# Altium project gpn-badge.PrjPcb
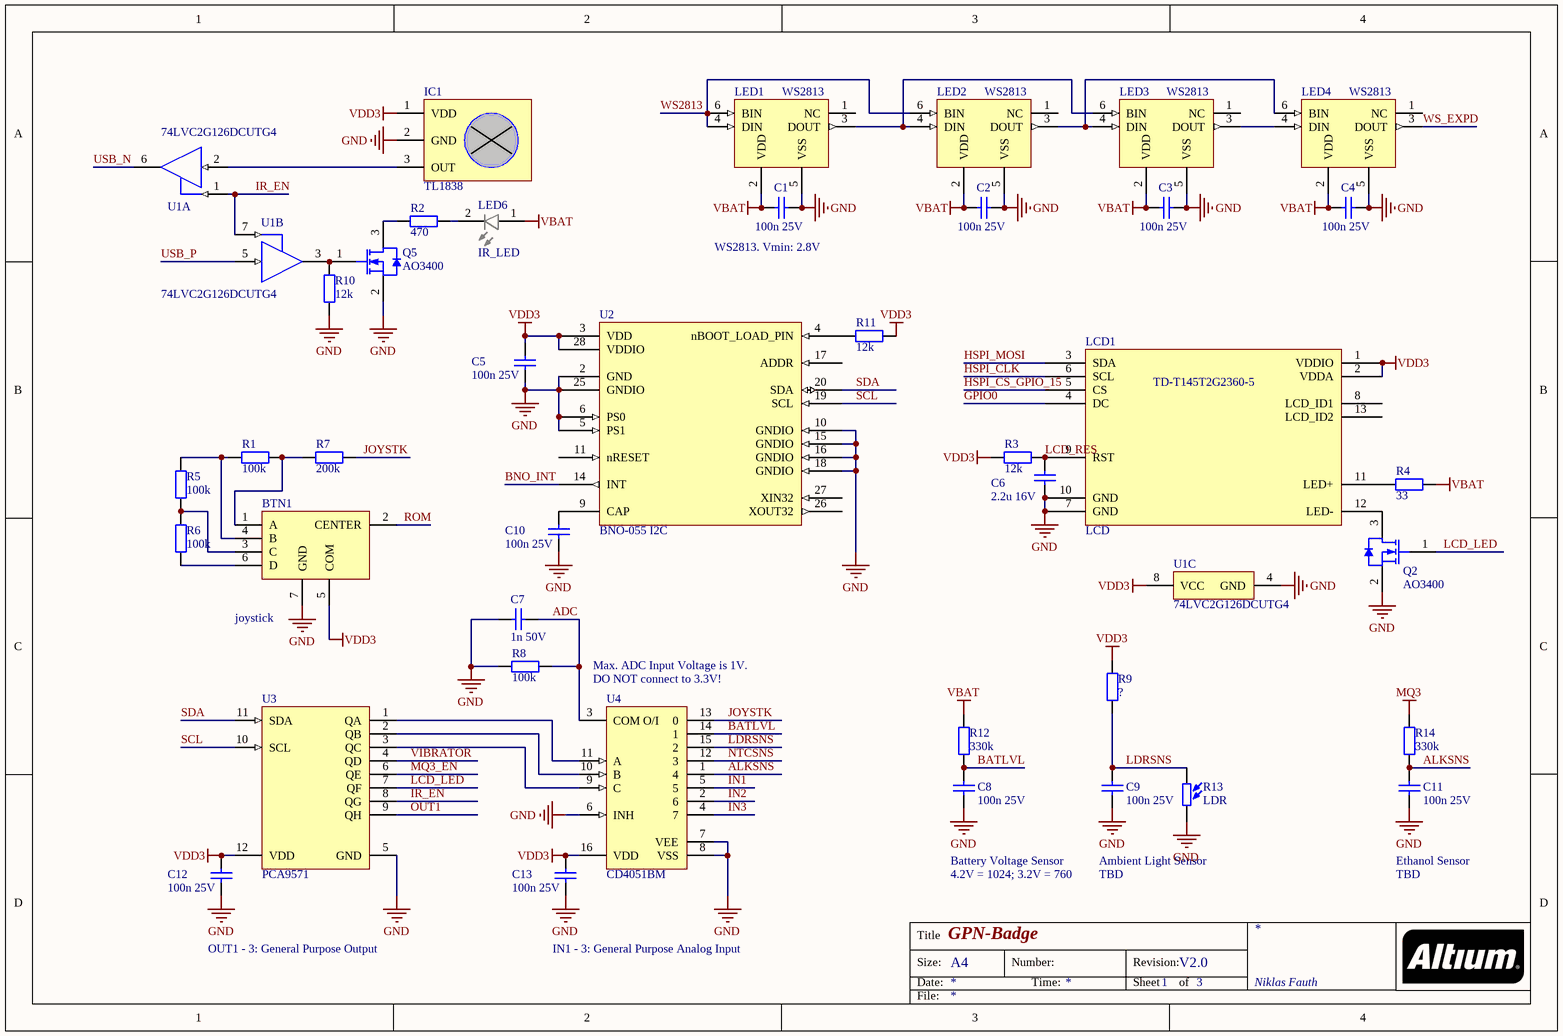
[diagram p0: gpio.SchDoc]
3 sheets, 112 parts. Net scope: global (net labels, ports and power ports of the same name join across sheets).
Board file: gpn-badge.PcbDoc
Sheets:
  gpio.SchDoc
  power.SchDoc
  cpu.SchDoc

## Sheet gpio.SchDoc: GPN-Badge
size A4; Address4: Niklas Fauth; Revision: V2.0; SheetNumber: 1; SheetTotal: 3

### Parts
BTN1  joystick  [joystick]
C1  100n 25V  [C-0603-M]
C2  100n 25V  [C-0603-M]
C3  100n 25V  [C-0603-M]
C4  100n 25V  [C-0603-M]
C5  100n 25V  [C-0603-M]
C6  2.2u 16V  [C-0603-M]
C7  1n 50V  [C-0603-M]
C8  100n 25V  [C-0603-M]
C9  100n 25V  [C-0603-M]
C10  100n 25V  [C-0603-M]
C11  100n 25V  [C-0603-M]
C12  100n 25V  [C-0603-M]
C13  100n 25V  [C-0603-M]
IC1  TL1838  [TL1838]
LCD1  LCD  [LCD]
LED1  WS2813  [plcc6]
LED2  WS2813  [plcc6]
LED3  WS2813  [plcc6]
LED4  WS2813  [plcc6]
LED6  IR_LED  [IR_LED]
Q2  AO3400  [AO-SOT23-3_V]
Q5  AO3400  [AO-SOT23-3_V]
R1  100k  [R-0603-M]
R2  470  [R-0603-M]
R3  12k  [R-0603-M]
R4  33  [R-0603-M]
R5  100k  [R-0603-M]
R6  100k  [R-0603-M]
R7  200k  [R-0603-H]
R8  100k  [R-0603-M]
R9  ?  [R-0603-M]
R10  12k  [R-0603-M]
R11  12k  [R-0603-M]
R12  330k  [R-0603-M]
R13  LDR  [LDR-5mm]
R14  330k  [R-0603-M]
U1  74LVC2G126DCUTG4  [DCU0008A_L]  (parts A,B,C of 3)
U2  BNO-055 I2C  [BNO-055]
U3  PCA9571  [SON40P210X100-10N]
U4  CD4051BM  [D0016A_M]

### Nets
GND: BTN1.7(GND) C1.1 C2.1 C3.1 C4.1 C5.1 C6.1 C7.1 C8.1 C9.1 C10.1 C11.1 C12.1 C13.1 IC1.2(GND) LCD1.7(GND) LCD1.10(GND) LED1.5(VSS) LED2.5(VSS) LED3.5(VSS) LED4.5(VSS) Q2.2(S) Q5.2(S) R8.1 R10.1 R13.2 U1.4(GND) U2.2(GND) U2.5(PS1) U2.6(PS0) U2.10(GNDIO) U2.15(GNDIO) U2.16(GNDIO) U2.18(GNDIO) U2.25(GNDIO) U3.5(GND) U4.6(INH) U4.7(VEE) U4.8(VSS)
MQ3: R14.2
VBAT: C1.2 C2.2 C3.2 C4.2 LED1.2(VDD) LED2.2(VDD) LED3.2(VDD) LED4.2(VDD) LED6.1(A) R4.2 R12.2
VDD3: BTN1.5(COM) C5.2 C12.2 C13.2 IC1.1(VDD) LCD1.1(VDDIO) LCD1.2(VDDA) R3.1 R9.2 R11.2 U1.8(VCC) U2.3(VDD) U2.28(VDDIO) U3.12(VDD) U4.16(VDD)
ADC: C7.2 R8.2 U4.3(COM_O/I)
ALKSNS: C11.2 R14.1 U4.1(4)
BATLVL: C8.2 R12.1 U4.14(1)
BNO_INT: U2.14(INT)
GPIO0: LCD1.4(DC)
HSPI_CLK: LCD1.6(SCL)
HSPI_CS_GPIO_15: LCD1.5(CS)
HSPI_MOSI: LCD1.3(SDA)
IN1: U4.5
IN2: U4.2(6)
IN3: U4.4(7)
IR_EN: U1.1(1OE) U1.7(2OE) U3.8(QG)
JOYSTK: R7.1 U4.13(0)
LCD_LED: Q2.1(G) U3.7(QF)
LCD_RES: C6.2 LCD1.9(RST) R3.2
LDRSNS: C9.2 R9.1 R13.1 U4.15(2)
MQ3_EN: U3.6(QE)
NTCSNS: U4.12(3)
OUT1: U3.9(QH)
ROM: BTN1.2(CENTER)
SCL: U2.19(SCL) U3.10(SCL)
SDA: U2.20(SDA) U3.11(SDA)
USB_N: U1.6(1Y)
USB_P: U1.5(2A)
VIBRATOR: U3.4(QD)
WS2813: LED1.4(DIN) LED1.6(BIN) LED2.6(BIN)
WS_EXPD: LED4.3(DOUT)
NetBTN1_1: BTN1.1(A) R1.2 R7.2
NetBTN1_3: BTN1.3(C) R5.1 R6.2
NetBTN1_4: BTN1.4(B) R1.1 R5.2
NetBTN1_6: BTN1.6(D) R6.1
NetC10_2: C10.2 U2.9(CAP)
NetIC1_3: IC1.3(OUT) U1.2(1A)
NetLCD1_11: LCD1.11(LED+) R4.1
NetLCD1_12: LCD1.12(LED-) Q2.3(D)
NetLED1_3: LED1.3(DOUT) LED2.4(DIN) LED3.6(BIN)
NetLED2_3: LED2.3(DOUT) LED3.4(DIN) LED4.6(BIN)
NetLED3_3: LED3.3(DOUT) LED4.4(DIN)
NetLED6_2: LED6.2(K) R2.2
NetQ5_1: Q5.1(G) R10.2 U1.3(2Y)
NetQ5_3: Q5.3(D) R2.1
NetR11_1: R11.1 U2.4(nBOOT_LOAD_PIN)
NetU3_1: U3.1(QA) U4.11(A)
NetU3_2: U3.2(QB) U4.10(B)
NetU3_3: U3.3(QC) U4.9(C)

Not connected (* = marked no-connect by the designer): LCD1 8(LCD_ID1) 13(LCD_ID2); LED1 1(NC); LED2 1(NC); LED3 1(NC); LED4 1(NC); U2 11(nRESET) 17(ADDR) 26(XOUT32) 27(XIN32)

### Notes on the sheet
- (near C1) WS2813. Vmin: 2.8V
- Max. ADC Input Voltage is 1V.
- DO NOT connect to 3.3V!
- Battery Voltage Sensor
- 4.2V = 1024; 3.2V = 760
- Ambient Light Sensor
- TBD
- Ethanol Sensor
- OUT1 - 3: General Purpose Output
- IN1 - 3: General Purpose Analog Input
- Title
- Size:
- Date:
- A4
- Number:
- Time:
- Revision:
- Sheet
- of
- File:
- (in symbol LCD) TD-T145T2G2360-5

### Library data of the parts
C1-C5 C8-C13 = C-0603-100n-25V: Capacitor 100n 25V; Supplier 1: Mouser; Supplier Part Number 1: 80-C0603C104K3R
C6 = C-0603-2u2-16V: Capacitor 2.2uF 16V; Supplier 1: Mouser; Supplier Part Number 1: 80-C0603C225K4P
C7 = C-0603-1n-50V: Capacitor 1nF 50V; Supplier 1: Mouser; Supplier Part Number 1: 80-C0603C102J5G
LED1-LED4 = WS2813: WS2813 Addressable LED
Q2 Q5 = CMP-0278-00001-1: N-channel Enhancement Mode Field-Effect Transistor; 5.8A/30V; Manufacturer: Alpha and Omega; Channel Type: N; Drain-Source Voltage Limit: 30 V; Junction Temperature: -55 to 150 degC; Gate-Source Voltage Limit: +/-12 V; PackageDescription: 3-Pin SOT23, 3.016 x 2.8 mm Body, 0.95 mm Pitch; ComponentLink2Description: Datasheet; DatasheetVersion: Rev.8, 12/2011; ComponentLink3URL: http://www.aosmd.com/res/packaging_information/SOT-23.pdf; Storage Temperature: -55 to 150 degC; ComponentLink3Description: Package Specification; PackageReference: SOT23; ComponentLink1Description: Manufacturer URL; Mounting Technology: Surface Mount; ComponentLink1URL: http://www.aosmd.com/; PartNumber: AO3400; ComponentLink2URL: http://www.aosmd.com/res/data_sheets/AO3400.pdf
R1 R5 R6 R8 = R-0603-100k: Resistor 100k; Supplier 1: Mouser; Supplier Part Number 1: 71-CRCW0603-100K-E3
R2 = R-0603-470: Resistor 470; Supplier 1: Mouser; Supplier Part Number 1: 71-CRCW0603-470K-E3
R3 R10 R11 = R-0603-12k: Resistor 12k; Supplier 1: Mouser; Supplier Part Number 1: 71-CRCW0603-12K-E3
R4 = R-0603-10: Resistor 10; Supplier 1: Mouser; Supplier Part Number 1: 71-CRCW0603-10-E3
R7 = R-0603-200k: Resistor 200k; Supplier 1: Mouser; Supplier Part Number 1: 71-CRCW0603-200K-E3
R9 R12 R14 = R-0603-300k: Resistor 300k; Resistance: 300k; Supplier 1: Mouser; Supplier Part Number 1: 71-CRCW0201300KFKED
U1 = CMP-0859-00683-3: Dual Bus Buffer Gate With 3-State Outputs, DCU0008A, SMALL T&R; Manufacturer: Texas Instruments; Generic Part Number: SN74LVC2G126; Voltage(Nom)(V): 1.8,2.5,3.3,5; Logic: True; Input Type: CMOS/TTL; tpd @ Nom Voltage(Max)(ns): 9.8,4.9,4,3.2; Output Drive (IOL/IOH)(Max)(mA): 32/-32; ICC @ Nom Voltage(Max)(mA): 0.01; Output Type: CMOS; Bits(#): 2; Schmitt Trigger: No; 3-State Output: Yes; Sub-Family: Non-Inverting Buffer/Driver; F @ Nom Voltage(Max)(Mhz): 150; VCC(Min)(V): 1.65; Technology Family: LVC; Rating: Catalog; VCC(Max)(V): 5.5; Operating Temperature Range(C): -40 to 125; DatasheetVersion: SCES205L; PackageReference: DCU0008A; PartId: 1
U2 = BNO-055-I2C: Bosch Sensortec 9-Axis motion fusion sensor; Supplier 1: Mouser; Supplier Part Number 1: 262-BNO055
U3 = PCA9571: I2C Port extender
U4 = CMP-1575-00043-4: CMOS Single 8-Channel Analog Multiplexer/Demultiplexer with Logic-Level Conversion, D0016A, TUBE; Manufacturer: Texas Instruments; Ron(Typ)(Ohms): 125; Configuration: 1 X 1：8 MUX; ICC(Typ)(mA): 0.00008; Ron(Max)(Ohms): 240; VCC(Min)(V): 5; VCC(Max)(V): 18; Crosstalk: Yes; Bandwidth(Max)(MHz): 20; Rating: Military; Output Drive (IOL/IOH)(Max)(mA): 1; DatasheetVersion: SCHS047G; Generic Part Number: CD4051B; Output Type: CMOS; PackageReference: D0016A; PackageVersion: http://www.ti.com/lit/ml/mpds178g/mpds178g.pdf; Operating Temperature Range(C): -55 to 125; Code_JEDEC: MS-012 variation AC

## Sheet power.SchDoc: GPN-Badge
size A4; Address4: Niklas Fauth; Revision: V2.0; SheetNumber: 2; SheetTotal: 3
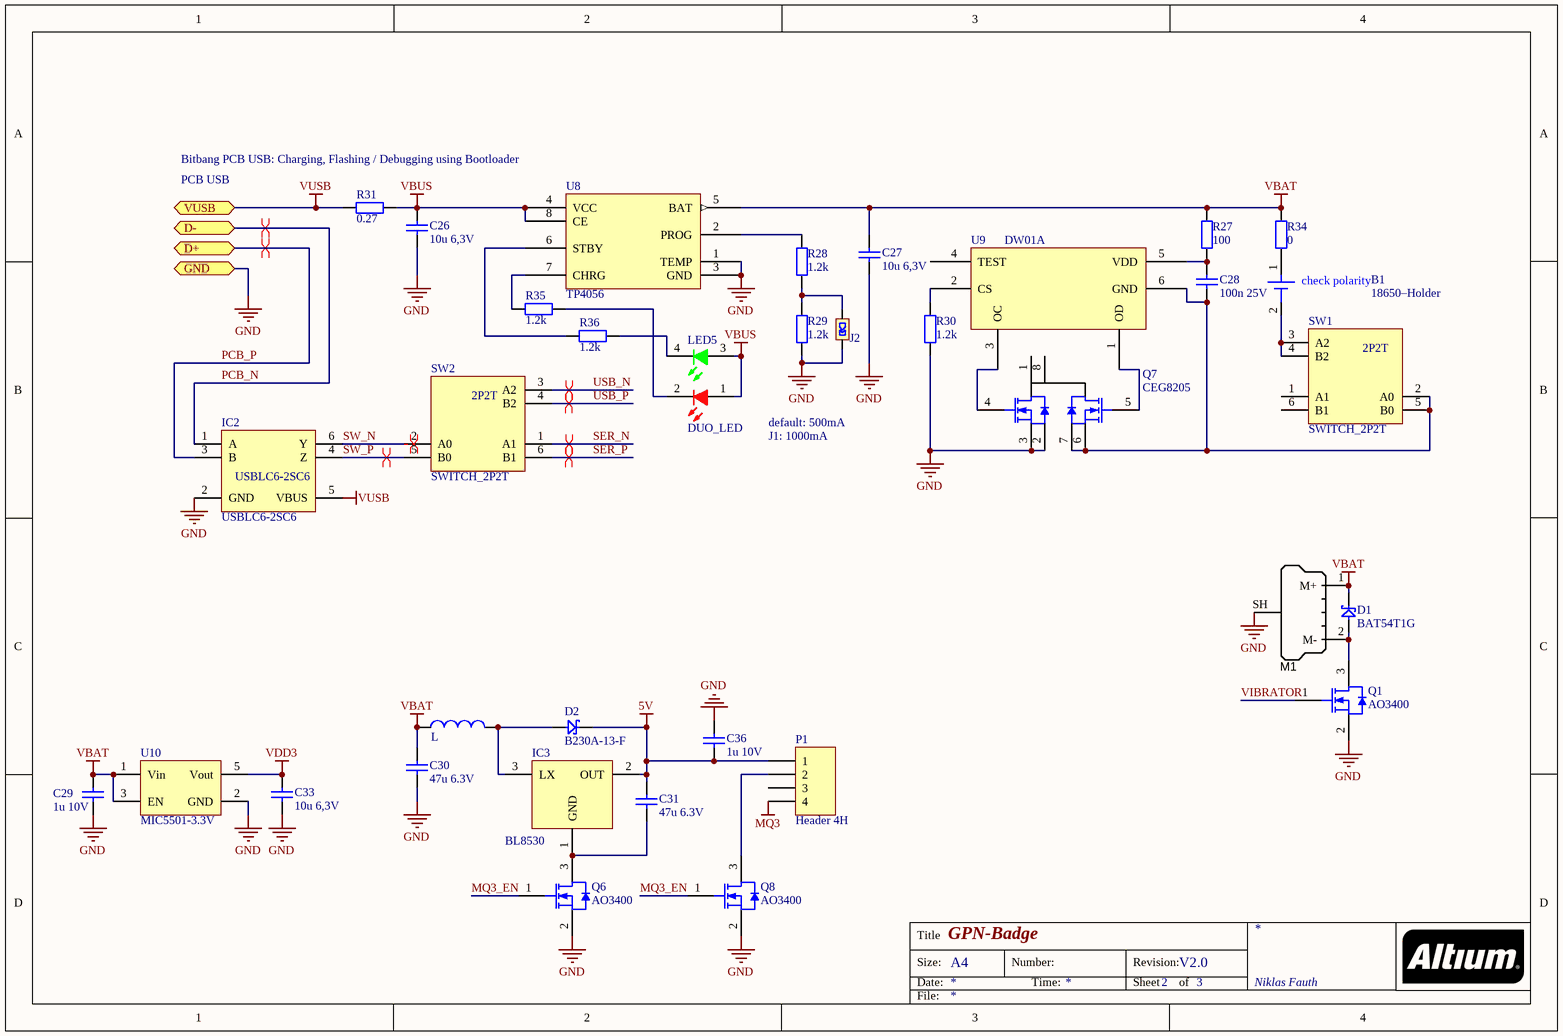
[diagram p1: power.SchDoc]

### Parts
*  L  [L]
B1  18650–Holder  [18650–Holder-SMD]
C26  10u 6,3V  [C-0603-H]
C27  10u 6,3V  [C-0603-H]
C28  100n 25V  [C-0603-M]
C29  1u 10V  [C-0603-M]
C30  47u 6.3V  [C-0805-M]
C31  47u 6.3V  [C-0805-M]
C33  10u 6,3V  [C-0603-H]
C36  1u 10V  [C-0603-M]
D1  BAT54T1G  [SOD123]
D2  B230A-13-F  [DIODE-SMA]
IC2  USBLC6-2SC6  [SOT23-6]
IC3  BL8530  [SOT89-150P409X160-3N]
J2  jumper  [JUMPER 1-1]  (value not drawn)
LED5  DUO_LED  [LEDDUO]
M1  VIBRATOR  [VIBRATOR_SMD]  (value not drawn)
P1  Header 4H  [HDR1X4H]
Q1  AO3400  [AO-SOT23-3_V]
Q6  AO3400  [AO-SOT23-3_V]
Q7  CEG8205  [SOP64P640X265-8N]
Q8  AO3400  [AO-SOT23-3_V]
R27  100  [R-0603-M]
R28  1.2k  [R-0603-M]
R29  1.2k  [R-0603-M]
R30  1.2k  [R-0603-M]
R31  0.27  [R-1206-M]
R34  0  [R-0603-M]
R35  1.2k  [R-0603-M]
R36  1.2k  [R-0603-M]
SW1  SWITCH_2P2T  [SWITCH_THT]
SW2  SWITCH_2P2T  [SWITCH_THT]
U8  TP4056  [SOIC127P600X20_HS-9N]
U9  DW01A  [SOT23-6]
U10  MIC5501-3.3V  [SOT23-5]

### Ports
D+, D-, GND, VUSB

### Nets
5V: C31.2 C36.2 D2.2(kt) IC3.2(OUT) P1.1
GND: C26.1 C27.1 C29.1 C30.1 C33.1 C36.1 IC2.2(GND) J2.2 M1.SH(Shell) Q1.2(S) Q6.2(S) Q7.2(S1) Q7.3(S1) Q8.2(S) R29.1 R30.1 U8.1(TEMP) U8.3(GND) U10.2(GND) ; port GND
MQ3: P1.4
VBAT: *.1 C27.2 C29.2 C30.2 D1.2(kt) M1.1(M+) R27.2 R34.2 U8.5(BAT) U10.1(Vin) U10.3(EN)
VBUS: C26.2 LED5.1(A) LED5.3(A) R31.2 U8.4(VCC) U8.8(CE)
VDD3: C33.2 U10.5(Vout)
VUSB: IC2.5(VBUS) R31.1 ; port VUSB
MQ3_EN: Q6.1(G) Q8.1(G)
PCB_N: IC2.1(A) ; port D-
PCB_P: IC2.3(B) ; port D+
SER_N: SW2.1(A1)
SER_P: SW2.6(B1)
SW_N: IC2.6(Y) SW2.2(A0)
SW_P: IC2.4(Z) SW2.5(B0)
USB_N: SW2.3(A2)
USB_P: SW2.4(B2)
VIBRATOR: Q1.1(G)
Net*_2: *.2 D2.1(an) IC3.3(LX)
NetB1_1: B1.1 R34.1
NetB1_2: B1.2 SW1.3(A2) SW1.4(B2)
NetC28_1: C28.1 Q7.6(S2) Q7.7(S2) SW1.2(A0) SW1.5(B0) U9.6(GND)
NetC28_2: C28.2 R27.1 U9.5(VDD)
NetC31_1: C31.1 IC3.1(GND) Q6.3(D)
NetD1_1: D1.1(an) M1.2(M-) Q1.3(D)
NetJ2_1: J2.1 R28.1 R29.2
NetLED5_2: LED5.2(K) R35.1
NetLED5_4: LED5.4(K) R36.1
NetP1_2: P1.2 Q8.3(D)
NetQ7_4: Q7.4(G1) U9.3(OC)
NetQ7_5: Q7.5(G2) U9.1(OD)
NetR28_2: R28.2 U8.2(PROG)
NetR30_2: R30.2 U9.2(CS)
NetR35_2: R35.2 U8.7(CHRG)
NetR36_2: R36.2 U8.6(STBY)

Not connected (* = marked no-connect by the designer): P1 3; Q7 1(S) 8(D); SW1 1(A1) 6(B1); U9 4(TEST)

### Layout directives
differential pair: PCB_N, PCB_P, SER_N, SER_P, SW_N, SW_P, USB_N, USB_P

### Notes on the sheet
- Bitbang PCB USB: Charging, Flashing / Debugging using Bootloader
- PCB USB
- default: 500mA
- J1: 1000mA
- Title
- Size:
- Date:
- A4
- Number:
- Time:
- Revision:
- Sheet
- of
- File:
- (in symbol 18650–Holder) check polarity
- (in symbol SWITCH_2P2T) 2P2T
- (in symbol SWITCH) ON/OFF

### Library data of the parts
C26 C27 C33 = C-0603-10u-6,3V: Capacitor 10uF 6,3V; Supplier 1: Mouser; Supplier Part Number 1: 80-C0603C106M9P
C28 = C-0603-100n-25V: Capacitor 100n 25V; Supplier 1: Mouser; Supplier Part Number 1: 80-C0603C104K3R
C29 C36 = C-0603-1u-10V: Capacitor 1uF 10V; Supplier 1: Mouser; Supplier Part Number 1: 80-C0603C105K8P
C30 C31 = C-0805-47u-6.3V: Capacitor 47u 6.3V; Supplier 1: Mouser; Supplier Part Number 1: 80-C0805C476M9P
D1 = D-BAT54T1G: Supplier 1: Mouser; Supplier Part Number 1: 863-BAT54T1G
D2 = D-B230A-13-F: Supplier 1: Mouser; Supplier Part Number 1: 621-B230A-F
IC2 = USBLC6-2SC6: USB protection
J2 = jumper 1-1
M1 = VIBRATOR: rawr
P1 = Header 4H: Header, 4-Pin, Right Angle; LatestRevisionDate: 17-Jul-2002; LatestRevisionNote: Re-released for DXP Platform.; Publisher: Altium Limited
Q1 Q6 Q8 = CMP-0278-00001-1: as Q2 on sheet gpio; PackageDescription: 3-Pin SOT23, 3.016 x 2.8 mm Body, 0.95 mm Pitch; ComponentLink2Description: Datasheet; DatasheetVersion: Rev.8, 12/2011; ComponentLink3URL: http://www.aosmd.com/res/packaging_information/SOT-23.pdf; Storage Temperature: -55 to 150 degC; ComponentLink3Description: Package Specification; PackageReference: SOT23; ComponentLink1Description: Manufacturer URL; Mounting Technology: Surface Mount; ComponentLink1URL: http://www.aosmd.com/; PartNumber: AO3400; ComponentLink2URL: http://www.aosmd.com/res/data_sheets/AO3400.pdf
Q7 = MOSFET-CEG8205: Dual mini mosfet 20V 4.5A; Supplier 1: AliExpress
R27 = R-0603-100: Resistor 100; Supplier 1: Mouser; Supplier Part Number 1: 71-CRCW0603-100-E3
R28-R30 R35 R36 = R-0603-1k2: Resistor 1.2k
R31 = R-1206-0R27: Resistor 0.27; Supplier 1: Mouser; Supplier Part Number 1: 71-RCWE1206R270FKEA
R34 = R-0603-0: Resistor 0; Supplier 1: Mouser; Supplier Part Number 1: 71-CRCW0603-0-E3; Resistance: 0
U8 = TP4056: 1A standalone linear charging IC; Supplier 1: AliExpress
U9 = DW01A: Single Cell LiIon LiPo Protection
U10 = MIC5501-3.3V: Supplier 1: Mouser; Supplier Part Number 1: 998-MIC5501-3.0YM5TR

## Sheet cpu.SchDoc: GPN-Badge
size A4; Address4: Niklas Fauth; Revision: V2.0; SheetNumber: 3; SheetTotal: 3; PageSetup: Record=PageOptions|CenterHorizontal=True|CenterVertical=True|PrintScale=1.00|XCorrection=1.00|YCorrection=1.00|PrintKind=1|BorderSize=5000000|LeftOffset=0|BottomOffset=0|Orientation=2|PaperLength=1000|PaperWidth=1000|Scale=100|PaperSource=7|PrintQuality=-3|MediaType=1|DitherType=10|PrintScaleMode=1|PaperKind=12mm|PaperIndex=126
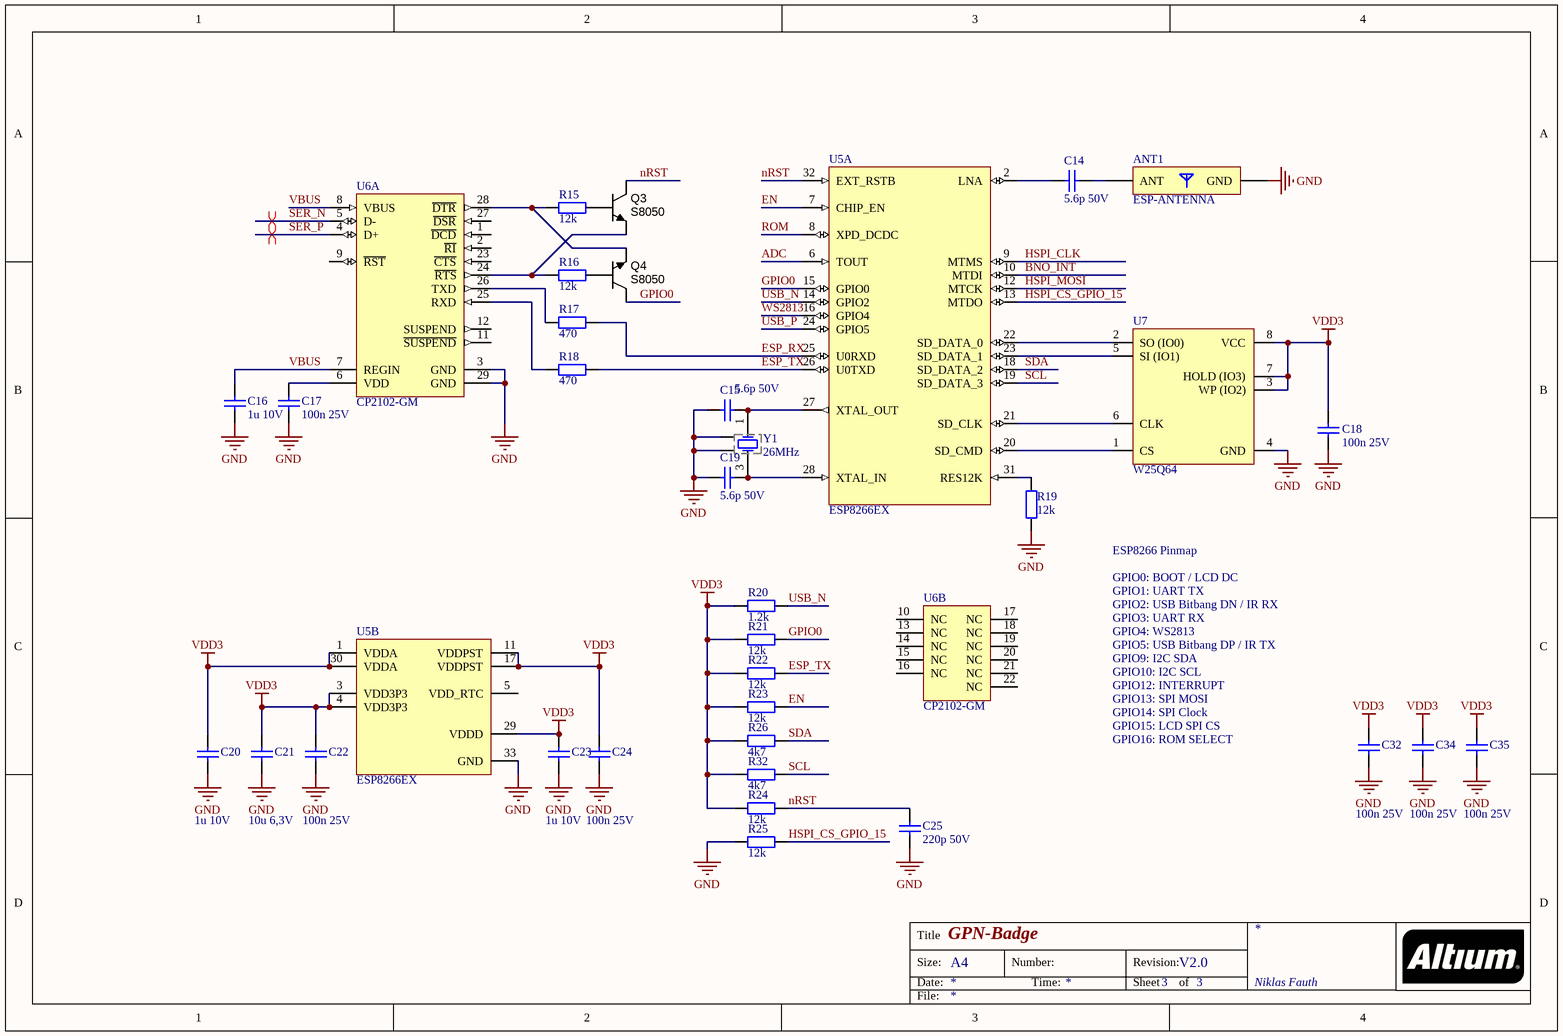
[diagram p2: cpu.SchDoc]

### Parts
(Parts that share a designator on the sheet are numbered #1, #2 ... from top to bottom, then left to right.)
ANT1  ESP-ANTENNA  [ESP8266_ANT]
C14  5.6p 50V  [C-0603-M]
C15  5.6p 50V  [C-0603-M]
C16  1u 10V  [C-0603-M]
C17  100n 25V  [C-0603-M]
C18  100n 25V  [C-0603-M]
C19  5.6p 50V  [C-0603-M]
C20  1u 10V  [C-0603-M]
C21  10u 6,3V  [C-0603-H]
C22  100n 25V  [C-0603-M]
C23  1u 10V  [C-0603-M]
C24  100n 25V  [C-0603-M]
C25  220p 50V  [C-0603-M]
C32  100n 25V  [C-0603-M]
C34  100n 25V  [C-0603-M]
C35  100n 25V  [C-0603-M]
Q3  Manufacturer Part Number 1: S8050  [SOT23-3]  (hidden comment: NPN_MMBT3904)
Q4  Manufacturer Part Number 1: S8050  [SOT23-3]  (hidden comment: NPN_MMBT3904)
R15  12k  [R-0603-M]
R16  12k  [R-0603-M]
R17  470  [R-0603-M]
R18  470  [R-0603-M]
R19  12k  [R-0603-M]
R20  1.2k  [R-0603-M]
R21  12k  [R-0603-M]
R22  12k  [R-0603-M]
R23  12k  [R-0603-M]
R24  12k  [R-0603-M]
R25  12k  [R-0603-M]
R26  4k7  [R-0603-M]
R32  4k7  [R-0603-M]
U5  ESP8266EX  [QFN32-5x5mm]  (parts A,B of 2)
U6#1  CP2102-GM  [SLAB-QFN-28-3125x3125TP_M]  (part A of 2)
U6#2  CP2102-GM  [SLAB-QFN-28-3125x3125TP_N]  (part B of 2)
U7  W25Q64  [SOIC127P790X100-8N]
Y1  26MHz  [3225]

### Nets
GND: ANT1.2(GND) C15.1 C16.1 C17.1 C18.1 C19.1 C20.1 C21.1 C22.1 C23.1 C24.1 C25.1 C32.1 C34.1 C35.1 R19.2 R25.1 U5.33(GND) U6#1.3(GND) U6#1.29(GND) U7.4(GND) Y1.2 Y1.4
VBUS: C16.2 U6#1.7(REGIN) U6#1.8(VBUS)
VDD3: C18.2 C20.2 C21.2 C22.2 C23.2 C24.2 C32.2 C34.2 C35.2 R20.2 R21.1 R22.1 R23.1 R24.1 R26.1 R32.1 U5.1(VDDA) U5.3(VDD3P3) U5.4(VDD3P3) U5.11(VDDPST) U5.17(VDDPST) U5.29(VDDD) U5.30(VDDA) U7.3(WP_(IO2)) U7.7(HOLD_(IO3)) U7.8(VCC)
ADC: U5.6(TOUT)
BNO_INT: U5.10(MTDI)
EN: R23.2 U5.7(CHIP_EN)
ESP_RX: R17.2 U5.25(U0RXD)
ESP_TX: R18.2 R22.2 U5.26(U0TXD)
GPIO0: Q4.3(C) R21.2 U5.15(GPIO0)
HSPI_CLK: U5.9(MTMS)
HSPI_CS_GPIO_15: R25.2 U5.13(MTDO)
HSPI_MOSI: U5.12(MTCK)
nRST: C25.2 Q3.3(C) R24.2 U5.32(EXT_RSTB)
ROM: U5.8(XPD_DCDC)
SCL: R32.2 U5.19(SD_DATA_3)
SDA: R26.2 U5.18(SD_DATA_2)
SER_N: U6#1.5(D-)
SER_P: U6#1.4(D+)
USB_N: R20.1 U5.14(GPIO2)
USB_P: U5.24(GPIO5)
WS2813: U5.16(GPIO4)
NetANT1_1: ANT1.1(ANT) C14.2
NetC14_1: C14.1 U5.2(LNA)
NetC15_2: C15.2 U5.27(XTAL_OUT) Y1.1
NetC17_2: C17.2 U6#1.6(VDD)
NetC19_2: C19.2 U5.28(XTAL_IN) Y1.3
NetQ3_1: Q3.1(B) R15.2
NetQ3_2: Q3.2(E) R16.1 U6#1.24(~{RTS})
NetQ4_1: Q4.1(B) R16.2
NetQ4_2: Q4.2(E) R15.1 U6#1.28(~{DTR})
NetR17_1: R17.1 U6#1.26(TXD)
NetR18_1: R18.1 U6#1.25(RXD)
NetR19_1: R19.1 U5.31(RES12K)
NetU5_20: U5.20(SD_CMD) U7.1(CS)
NetU5_21: U5.21(SD_CLK) U7.6(CLK)
NetU5_22: U5.22(SD_DATA_0) U7.2(SO_(IO0))
NetU5_23: U5.23(SD_DATA_1) U7.5(SI_(IO1))

Not connected (* = marked no-connect by the designer): U5 5(VDD_RTC); U6#1 1(~{DCD}) 2(~{RI}) 9(~{RST}) 11(~{SUSPEND}) 12(SUSPEND) 23(~{CTS}) 27(~{DSR}); U6#2 10(NC) 13(NC) 14(NC) 15(NC) 16(NC) 17(NC) 18(NC) 19(NC) 20(NC) 21(NC) 22(NC)

### Layout directives
differential pair: SER_N, SER_P

### Notes on the sheet
- GPIO0: BOOT / LCD DC
- ESP8266 Pinmap
- GPIO1: UART TX
- GPIO3: UART RX
- GPIO2: USB Bitbang DN / IR RX
- GPIO4: WS2813
- GPIO5: USB Bitbang DP / IR TX
- GPIO9: I2C SDA
- GPIO10: I2C SCL
- GPIO12: INTERRUPT
- GPIO13: SPI MOSI
- GPIO14: SPI Clock
- GPIO15: LCD SPI CS
- GPIO16: ROM SELECT
- Title
- Size:
- Date:
- A4
- Number:
- Time:
- Revision:
- Sheet
- of
- File:

### Library data of the parts
ANT1 = ESP-ANT
C14 C15 C19 = C-0603-5p6-50V: Capacitor 5.6pF 50V; Supplier 1: Mouser; Supplier Part Number 1: 80-C0603C569C5GACTM
C16 C20 C23 = C-0603-1u-10V: Capacitor 1uF 10V; Supplier 1: Mouser; Supplier Part Number 1: 80-C0603C105K8P
C17 C18 C22 C24 C32 C34 C35 = C-0603-100n-25V: Capacitor 100n 25V; Supplier 1: Mouser; Supplier Part Number 1: 80-C0603C104K3R
C21 = C-0603-10u-6,3V: Capacitor 10uF 6,3V; Supplier 1: Mouser; Supplier Part Number 1: 80-C0603C106M9P
C25 = C-0603-220p-50V: Capacitor 220p 50V; Supplier 1: Mouser; Supplier Part Number 1: 80-C0603C221F5GAC
Q3 Q4 = NPN_MMBT3904: Transistor SMD NPN 40V 0.2A 250mW SOT-23; Manufacturer 1: Fairchild Semiconductor; Ratings: 40V; 200mA; 250mW; Material: Si; SCDType: source; Package / Case: SOT-23; Supplier 1: Digi-Key; Supplier Part Number 1: MMBT3904FSCT-ND; Transistor Type: NPN; Mounting Type: Surface Mount; Supplier 2: Digi-Key; Supplier Part Number 2: 568-1741-1-ND; Manufacturer 2: NXP Semiconductors; Manufacturer Part Number 2: PMBT3904,215; ComponentLink2URL: http://www.nxp.com/documents/data_sheet/PMBT3904.pdf; ComponentLink2Description: http://www.nxp.com/documents/data_sheet/PMBT3904.pdf; ComponentLink1URL: http://www.fairchildsemi.com/ds/MM/MMBT3904.pdf; ComponentLink1Description: http://www.fairchildsemi.com/ds/MM/MMBT3904.pdf
R15 R16 R19 R21-R25 = R-0603-12k: Resistor 12k; Supplier 1: Mouser; Supplier Part Number 1: 71-CRCW0603-12K-E3
R17 R18 = R-0603-470: Resistor 470; Supplier 1: Mouser; Supplier Part Number 1: 71-CRCW0603-470K-E3
R20 = R-0603-1k2: Resistor 1.2k
R26 R32 = R-0603-4k7: Resistor 4k7; Supplier 1: Mouser; Supplier Part Number 1: 71-CRCW0603-4.7K-E3
U6#1 U6#2 = CMP-0511-00012-1: Single-Chip USB to UART Bridge, 1024 Bytes EEPROM, -40 to 85 degC, 28-pin QFN, Tube; Manufacturer: Silicon Labs; Internal Oscillator: TRUE; Sub-Family: USB Bridges; ComponentLink3Description: Package Specification; PackageDescription: 28-Pin Quad-Flat No-Leads Package, Body 5 x 5 mm, Pitch 0.5 mm; PartNumber: CP2102-GM; EEPROM: 1024 Bytes; Mounting Technology: Surface Mount; ComponentLink2URL: http://www.silabs.com/Support%20Documents/TechnicalDocs/CP2102-9.pdf; DatasheetVersion: Rev. 1.5; ComponentLink1URL: http://www.silabs.com/; ComponentLink2Description: Datasheet; Code_JEDEC: MO-220; PackageReference: QFN-28; Code_IPC: J-STD-020C; ComponentLink3URL: http://www.silabs.com/Support%20Documents/TechnicalDocs/C8051T61x.pdf; ComponentLink1Description: Manufacturer URL; PartId: 1
U7 = W25Q64: 8MB / 64Mib Flash
Y1 = 3225-26MHz

## Nets that join several sheets
GND: gpio (39 pins), power (19 pins), cpu (23 pins)
MQ3: gpio (R14.2), power (P1.4)
VBAT: gpio (11 pins), power (11 pins)
VBUS: power (6 pins), cpu (C16.2 U6#1.7 U6#1.8)
VDD3: gpio (15 pins), power (C33.2 U10.5), cpu (26 pins)
ADC: gpio (C7.2 R8.2 U4.3), cpu (U5.6)
BNO_INT: gpio (U2.14), cpu (U5.10)
GPIO0: gpio (LCD1.4), cpu (Q4.3 R21.2 U5.15)
HSPI_CLK: gpio (LCD1.6), cpu (U5.9)
HSPI_CS_GPIO_15: gpio (LCD1.5), cpu (R25.2 U5.13)
HSPI_MOSI: gpio (LCD1.3), cpu (U5.12)
MQ3_EN: gpio (U3.6), power (Q6.1 Q8.1)
ROM: gpio (BTN1.2), cpu (U5.8)
SCL: gpio (U2.19 U3.10), cpu (R32.2 U5.19)
SDA: gpio (U2.20 U3.11), cpu (R26.2 U5.18)
SER_N: power (SW2.1), cpu (U6#1.5)
SER_P: power (SW2.6), cpu (U6#1.4)
USB_N: gpio (U1.6), power (SW2.3), cpu (R20.1 U5.14)
USB_P: gpio (U1.5), power (SW2.4), cpu (U5.24)
VIBRATOR: gpio (U3.4), power (Q1.1)
WS2813: gpio (LED1.4 LED1.6 LED2.6), cpu (U5.16)